# Altium schematic sheet P10_Expander.SchDoc
size 177 x 101 mm
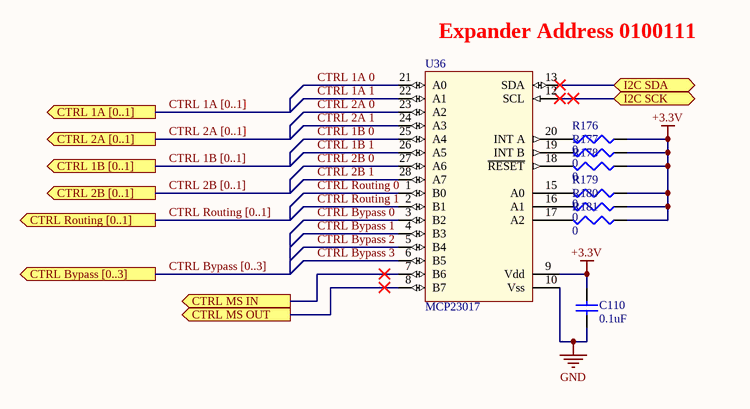
[diagram p0: P10_Expander.SchDoc]

## Parts
C110  0.1uF  [CAP 0603 (1608 metric)]
R176  0  [RES 0603 (1608 metric)]
R177  0  [RES 0603 (1608 metric)]
R178  0  [RES 0603 (1608 metric)]
R179  0  [RES 0603 (1608 metric)]
R180  0  [RES 0603 (1608 metric)]
R181  0  [RES 0603 (1608 metric)]
U36  MCP23017

## Ports
CTRL 1A [0..1] (out), CTRL 1B [0..1] (out), CTRL 2A [0..1] (out), CTRL 2B [0..1] (out), CTRL Bypass [0..3] (out), CTRL MS IN (out), CTRL MS OUT (out), CTRL Routing [0..1] (out), I2C SCK, I2C SDA

## Nets
+3.3V: C110.1 R176.1 R177.1 R178.1 R179.1 R180.1 R181.1 U36.9(Vdd)
GND: C110.2 U36.10(Vss)
CTRL 1A 0: U36.21(A0)
CTRL 1A 1: U36.22(A1)
CTRL 1B 0: U36.25(A4)
CTRL 1B 1: U36.26(A5)
CTRL 2A 0: U36.23(A2)
CTRL 2A 1: U36.24(A3)
CTRL 2B 0: U36.27(A6)
CTRL 2B 1: U36.28(A7)
CTRL Bypass 0: U36.3(B2)
CTRL Bypass 1: U36.4(B3)
CTRL Bypass 2: U36.5(B4)
CTRL Bypass 3: U36.6(B5)
CTRL MS IN: U36.7(B6) ; port CTRL MS IN
CTRL MS OUT: U36.8(B7) ; port CTRL MS OUT
CTRL Routing 0: U36.1(B0)
CTRL Routing 1: U36.2(B1)
I2C SCK: U36.12(SCL) ; port I2C SCK
I2C SDA: U36.13(SDA) ; port I2C SDA
NetR176_2: R176.2 U36.20(INT_A)
NetR177_2: R177.2 U36.19(INT_B)
NetR178_2: R178.2 U36.18(~{RESET})
NetR179_2: R179.2 U36.15(A0)
NetR180_2: R180.2 U36.16(A1)
NetR181_2: R181.2 U36.17(A2)

## Buses and harness runs
bus CTRL 1A [0..1] = port CTRL 1A [0..1]
bus CTRL 1B [0..1] = port CTRL 1B [0..1]
bus CTRL 2A [0..1] = port CTRL 2A [0..1]
bus CTRL 2B [0..1] = port CTRL 2B [0..1]
bus CTRL Bypass [0..3] = port CTRL Bypass [0..3]
bus CTRL Routing [0..1] = port CTRL Routing [0..1]

## Notes on the sheet
- (near U36) Expander Address 0100111

## Library data of the parts
C110 = Cap Semi: Capacitor (Semiconductor SIM Model); Value: 0.1uF
R176-R181 = Res3: Resistor; Value: 0
U36 = MCP23017: 16b I/O Expander